# EAGLE schematic Panel (EAGLE 8.4.1)
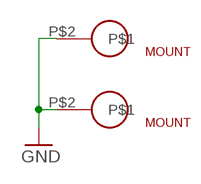
[diagram p0: schematic, sheet 1]

## Parts
U$1  MOUNTPLATED  [MOUNTING-FIRST-PLATED]
U$2  MOUNTPLATED  [MOUNTING-FIRST-PLATED]

## Nets
GND: U$1.P$2 U$2.P$2

## Library data of the parts
U$1 U$2 = barsstronics-mounting:MOUNT